# Altium schematic sheet Sheet1.SchDoc
size A4
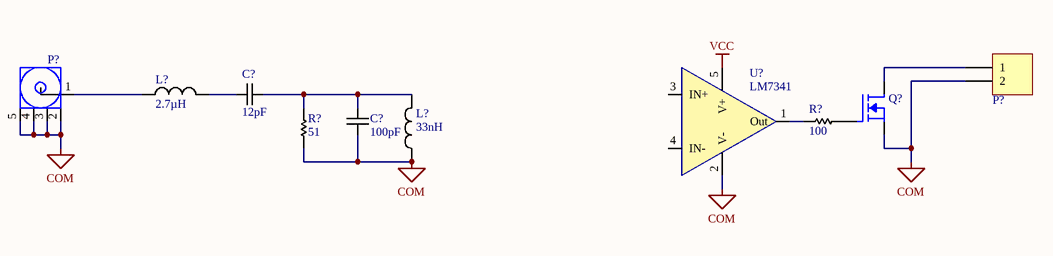
[diagram p0: Sheet1.SchDoc]

## Parts
(Parts that share a designator on the sheet are numbered #1, #2 ... from top to bottom, then left to right.)
C?#1  12pF  [0805 - Cap Non-Polarized]
C?#2  100pF  [0805 - Cap Non-Polarized]
L?#1  2.7µH  [1812 - Inductor]
L?#2  33nH  [1008 - INDUCTOR]
P?#1  Header 1X2  [Headers - 1x2 - R/A - Lock]  (value not drawn)
P?#2  Coax-F  [Coax-BNC-THT-Vertical]  (value not drawn)
Q?  MOSFET_N  [SOT23-3]  (value not drawn)
R?#1  100  [0805 - Resistor]
R?#2  51  [0805 - Resistor]
U?  LM7341  [SOT23-5]

## Nets
COM: C?#2.1 L?#2.1 P?#1.2 P?#2.2(GND) P?#2.3(GND) P?#2.4(GND) P?#2.5(GND) Q?.2(S) R?#2.1 U?.2(V-)
VCC: U?.5(V+)
NetC?#1_1: C?#1.1 L?#1.2
NetC?#1_2: C?#1.2 C?#2.2 L?#2.2 R?#2.2
NetL?#1_1: L?#1.1 P?#2.1(Signal)
NetP?#1_1: P?#1.1 Q?.3(D)
NetQ?_1: Q?.1(G) R?#1.1
NetR?#1_2: R?#1.2 U?.1(Out)

Not connected (* = marked no-connect by the designer): U? 3(IN+) 4(IN-)

## Library data of the parts
C?#1 = Cap-TDK-CGA-12pF-0805: CAP CER 12PF 100V 5% NP0 0603; Manufacturer: TDK; Manufacturer No: CGA3E2C0G2A120J080AA; Sub Category: 0805; Part Number: Cap-TDK-CGA-12pF-0805; Category: Capacitor; Pin count: 2; Package: 0805; Series: CGA; Supplier 1: Digi-Key; Supplier Part Number 1: 445-12319-1-ND; ComponentLink1URL: http://product.tdk.com/capacitor/mlcc/en/documents/mlcc_automotive_midvoltage_en.pdf; ComponentLink1Description: Datasheet; Creation Date: 2013-09-25 17:50:57; Created by: Pier-Yves; Value: 12pF; Tolerance: ±5%; Height: 1.45mm; Voltage: 100V; Temperature: MLCC
C?#2 = Cap-TDK-CGA-100pF-0805: CAP CER 100PF 100V 5% NP0 0805; Manufacturer: TDK; Manufacturer No: CGA4C2C0G2A101J060AA; Sub Category: 0805; Part Number: Cap-TDK-CGA-100pF-0805; Category: Capacitor; Pin count: 2; Package: 0805; Series: CGA; Supplier 1: Digi-Key; Supplier Part Number 1: 445-6951-1-ND; ComponentLink1URL: http://product.tdk.com/capacitor/mlcc/en/documents/mlcc_automotive_midvoltage_en.pdf; ComponentLink1Description: Datasheet; Creation Date: 2013-09-19 19:23:33; Created by: Pier-Yves; Value: 100pF; Tolerance: 5%; Height: 1.45mm; Voltage: 100V; Temperature: MLCC
L?#1 = Ind-Panasonic-FB-2.7µH-1812: INDUCTOR 2.7 UH 10% 1812 SMD; Manufacturer: Panasonic Electronic Components; Manufacturer No: ELJ-FB2R7KF; Sub Category: 1812; Current: 400mA; Part Number: Ind-Panasonic-FB-2.7µH-1812; Category: Inductor; Pin count: 2; Package: 1812; Series: FB; Supplier 1: Digi-Key; Supplier Part Number 1: PCD1446CT-ND; ComponentLink1URL: http://industrial.panasonic.com/www-cgi/jvcr13pz.cgi?E+PZ+3+AGA0031+ELJFB2R7KF+7+WW; ComponentLink1Description: Datasheet; Creation Date: 2013-09-26 18:57:04; Created by: Pier-Yves; Value: 2.7µH; Tolerance: ±10%; Height: 3.4mm; Temperature: -20°C ~ 85°C
L?#2 = Murata-LQW2UA-Ind-AirCore-33nH: IND 33NH 1000MA SRF 1600MHZ 1008; Manufacturer: Murata Electronics North America; Manufacturer No: LQW2UAS33NJ00L; Sub Category: SMD; Tolerance: 5%; Current: 1A; Part Number: Murata-LQW2UA-Ind-AirCore-33nH; Category: Inductor; Pin count: 2; Package: 2520; Series: LQW2UA; Supplier 1: Digi-Key; Supplier Part Number 1: 490-5685-1-ND; ComponentLink1URL: http://search.murata.co.jp/Ceramy/image/img/PDF/ENG/L0075S0080LQW2UA.pdf; ComponentLink1Description: Datasheet; Creation Date: 2013-09-12 02:00:31; Created by: Frederic; Value: 33nH; Height: 1.83mm; Temperature: -55°C ~ 125°C
P?#1 = Header-0.100-R/A-Lock-1X2: Manufacturer: Molex Inc.; Manufacturer No: 0705530001; Sub Category: 100mils R/A lock; LatestRevisionDate: 17-Jul-2002; LatestRevisionNote: Re-released for DXP Platform.; Publisher: Altium Limited; Part Number: Header-0.100-R/A-Lock-1X2; Category: Header; Pin count: 2; Series: C-Grid® SL™ 70553; Supplier 1: Digi-Key; Supplier Part Number 1: WM4900-ND; ComponentLink1URL: http://www.molex.com/pdm_docs/sd/705530001_sd.pdf; ComponentLink1Description: Datasheet; Creation Date: 2013-06-28 14:36:17; Created by: Pier-Yves
P?#2 = coax-bnc-tht-vertical: CONN BNC JACK STR 50 OHM PCB; Manufacturer: TE Connectivity; Manufacturer No: 5-1634503-1; Sub Category: Coaxial; Value: 50Ohms; Part Number: coax-bnc-tht-vertical; Category: Connector; Pin count: 5; Series: AMP; Supplier 1: Digi-Key; Supplier Part Number 1: A97581-ND; ComponentLink1URL: http://www.te.com/commerce/DocumentDelivery/DDEController?Action=srchrtrv&DocNm=1634503&DocType=Customer+Drawing&DocLang=English; ComponentLink1Description: Datasheet; Creation Date: 2013-11-24 21:41:14; Created by: Pier-Yves; Temperature: -55°C ~ 85°C
Q? = 2N7002: MosFET Channel-N SOT-23-3 3.3A; Part Number: 2N7002; Manufacturer: Vishay Siliconix; Manufacturer No: SI2304DDS-T1-GE3; Sub Category: MOSFET-N; Value: Channel N; Power: 1.7W; Voltage: 30V; Category: Transistor; Pin count: 3; Package: SOT-23-3; Series: ÉTrenchFET; Supplier 1: Digi-Key; Supplier Part Number 1: SI2304DDS-T1-GE3CT-ND; ComponentLink1URL: http://www.vishay.com/docs/65175/si2304dd.pdf; ComponentLink1Description: Datasheet; Creation Date: 2013-06-28 13:51:31; Created by: Pier-Yves; Current: 3.3A
R?#1 = Yagao-RC0805-100: RES 100 OHM 1/8W 5% 0805 SMD; Manufacturer: Yagao; Manufacturer No: RC0805JR-07100RL; Sub Category: 0805; Part Number: Yagao-RC0805-100; Category: Resistor; Pin count: 2; Package: 0805; Series: RC0805; Supplier 1: Digi-Key; Supplier Part Number 1: 311-100ARCT-ND; ComponentLink1URL: http://media.digikey.com/pdf/Data%20Sheets/Yageo%20PDFs/RC0805%20Pb%20Free.pdf; ComponentLink1Description: Datasheet; Creation Date: 2013-06-28 03:21:03; Created by: Pier-Yves; Value: 100; Tolerance: 5%; Power: 1/8W; Height: 0.6mm
R?#2 = Yagao-RC0805-51: RES 51 OHM 1/8W 5% 0805 SMD; Manufacturer: Yagao; Manufacturer No: RC0805JR-0751RL; Sub Category: 0805; Part Number: Yagao-RC0805-51; Category: Resistor; Pin count: 2; Package: 0805; Series: RC0805; Supplier 1: Digi-Key; Supplier Part Number 1: 311-51ARCT-ND; ComponentLink1URL: http://media.digikey.com/pdf/Data%20Sheets/Yageo%20PDFs/RC0805%20Pb%20Free.pdf; ComponentLink1Description: Datasheet; Creation Date: 2013-06-28 03:21:03; Created by: Pier-Yves; Value: 51; Tolerance: 5%; Power: 1/8W; Height: 0.6mm
U? = LM7341MF: IC OPAMP GP 4.6MHZ RRO SOT23-5; Manufacturer: Texas Instrument; Manufacturer No: LM7341MF/NOPB; Value: ±16V; Current: 13mA; Part Number: LM7341MF; Category: IC; Sub Category: OpAmp; Pin count: 5; Package: SOT23-5; Supplier 1: Digi-Key; Supplier Part Number 1: LM7341MF/NOPBCT-ND; ComponentLink1URL: http://www.ti.com/lit/ds/symlink/lm7341.pdf; ComponentLink1Description: Datasheet; Creation Date: 2013-10-17 19:55:30; Created by: Pier-Yves; Height: 1,45mm; Temperature: -40°C ~ 125°C